# EAGLE schematic Test2 (EAGLE 7.2.0)
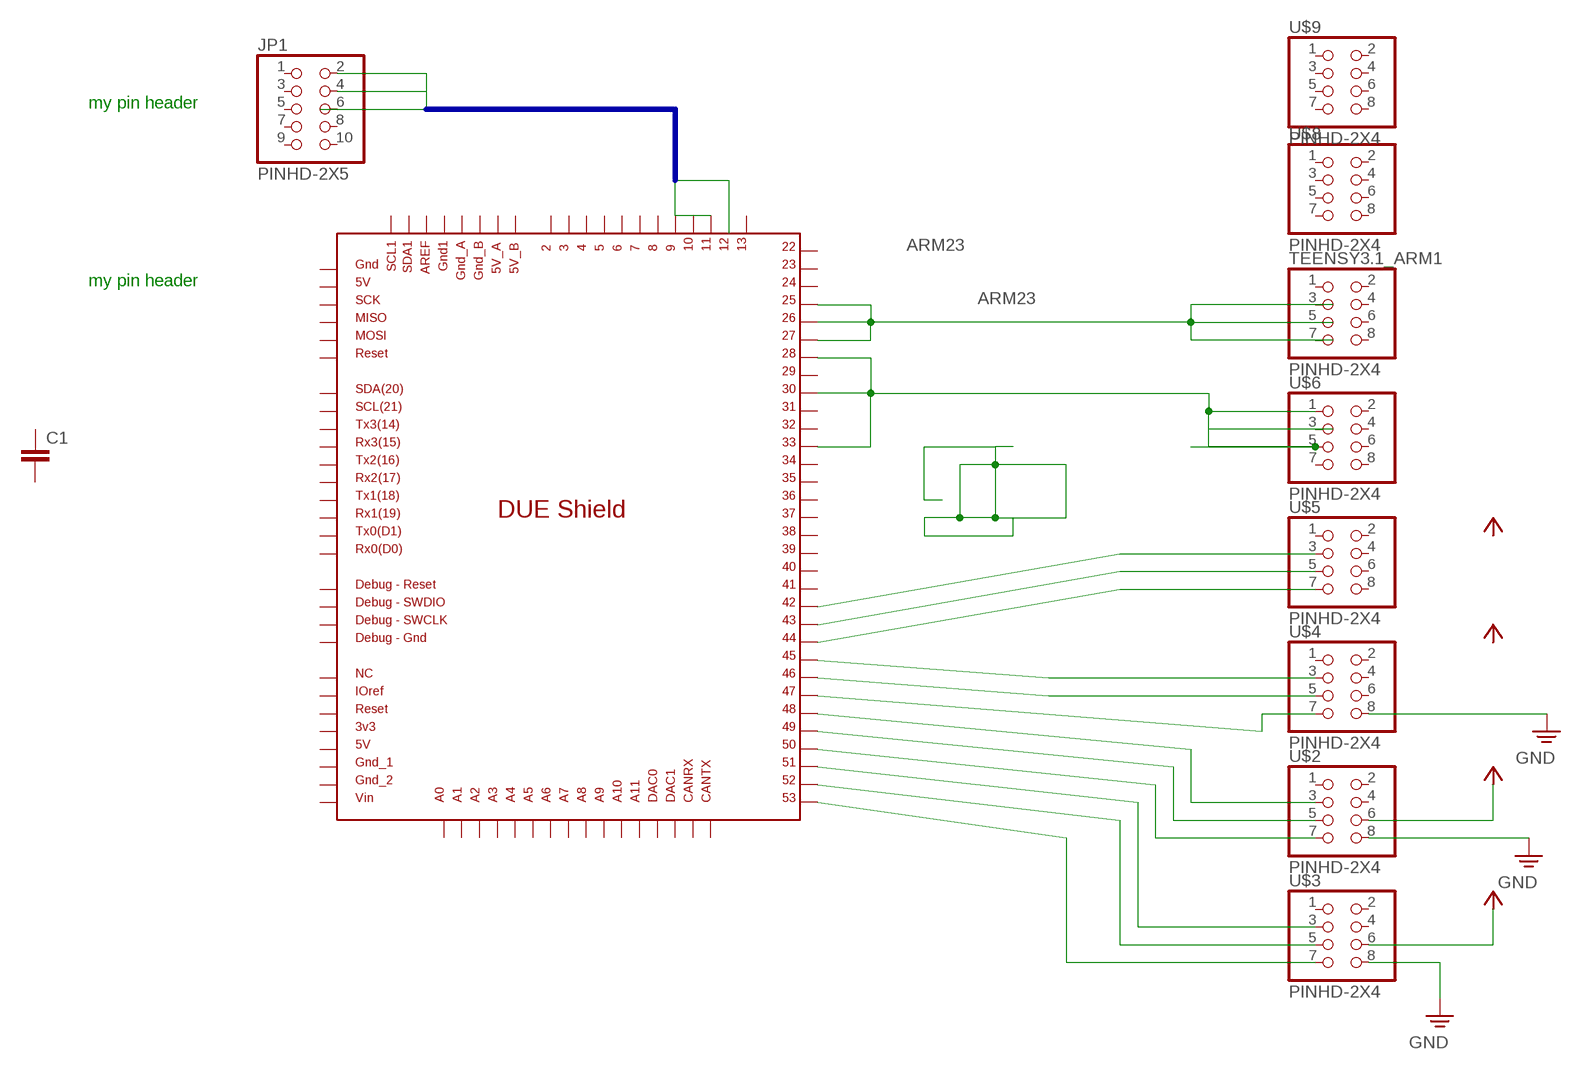
[diagram p0: schematic, sheet 1]

## Parts
C1  C_0201  [0201]
JP1  PINHD-2X5  [2X05]
TEENSY3.1_ARM1  PINHD-2X4  [2X04-BIG]
U$1  DUE(NORMAL)  [DUE(NORMAL)]
U$2  PINHD-2X4  [2X04-BIG]
U$3  PINHD-2X4  [2X04-BIG]
U$4  PINHD-2X4  [2X04-BIG]
U$5  PINHD-2X4  [2X04-BIG]
U$6  PINHD-2X4  [2X04-BIG]
U$8  PINHD-2X4  [2X04-BIG]
U$9  PINHD-2X4  [2X04-BIG]

## Nets
ARM23: U$1.25 U$1.26 U$1.27
B$1: JP1.2 JP1.4 U$1.11
GND: U$2.8 U$3.8 U$4.8
N$1: U$1.53 U$3.7
N$2: U$1.52 U$3.5
N$3: U$1.51 U$3.3
N$4: U$1.50 U$2.7
N$5: U$1.49 U$2.5
N$6: U$1.48 U$2.3
N$7: U$1.47 U$4.7
N$8: U$3.6
N$9: U$1.46 U$4.5
N$10: U$1.45 U$4.3
N$11: U$1.44 U$5.7
N$12: U$1.43 U$5.5
N$13: U$1.42 U$5.3
N$14: U$2.6
N$15: U$1.28 U$1.30 U$1.33 U$6.1 U$6.5
Unconnected: C1.1 C1.2 JP1.1 JP1.3 JP1.5 JP1.6 JP1.7 JP1.8 JP1.9 JP1.10 TEENSY3.1_ARM1.1 TEENSY3.1_ARM1.2 TEENSY3.1_ARM1.3 TEENSY3.1_ARM1.4 TEENSY3.1_ARM1.5 TEENSY3.1_ARM1.6 TEENSY3.1_ARM1.7 TEENSY3.1_ARM1.8 U$1.2 U$1.3 U$1.3V3 U$1.4 U$1.5 U$1.5V U$1.5V_A U$1.5V_B U$1.5V_ICSP U$1.6 U$1.7 U$1.8 U$1.9 U$1.10 U$1.12 U$1.13 U$1.22 U$1.23 U$1.24 U$1.29 U$1.31 U$1.32 U$1.34 U$1.35 U$1.36 U$1.37 U$1.38 U$1.39 U$1.40 U$1.41 U$1.A0 U$1.A1 U$1.A2 U$1.A3 U$1.A4 U$1.A5 U$1.A6 U$1.A7 U$1.A8 U$1.A9 U$1.A10 U$1.A11 U$1.AREF U$1.CANRX U$1.CANTX U$1.DAC0 U$1.DAC1 U$1.GND1 U$1.GND_1 U$1.GND_2 U$1.GND_A U$1.GND_B U$1.GND_DEBUG U$1.GND_ICSP U$1.IOREF U$1.MISO_ICSP U$1.MOSI_ICSP U$1.NC U$1.RESET U$1.RESET_DEBUG U$1.RESET_ICSP U$1.RX0 U$1.RX1 U$1.RX2 U$1.RX3 U$1.SCK_ICSP U$1.SCL U$1.SCL1 U$1.SDA U$1.SDA1 U$1.SWCLK_DEBUG U$1.SWDIO_DEBUG U$1.TX0 U$1.TX1 U$1.TX2 U$1.TX3 U$1.VIN U$2.1 U$2.2 U$2.4 U$3.1 U$3.2 U$3.4 U$4.1 U$4.2 U$4.4 U$4.6 U$5.1 U$5.2 U$5.4 U$5.6 U$5.8 U$6.2 U$6.3 U$6.4 U$6.6 U$6.7 U$6.8 U$8.1 U$8.2 U$8.3 U$8.4 U$8.5 U$8.6 U$8.7 U$8.8 U$9.1 U$9.2 U$9.3 U$9.4 U$9.5 U$9.6 U$9.7 U$9.8

## Buses
B$1

## Notes on the sheet
- my pin header
- my pin header

## Library data of the parts
C1 = jonnew:C: Capacitor
JP1 = jonnew:PINHD-2X5
TEENSY3.1_ARM1 U$2-U$6 U$8 U$9 = jonnew:PINHD-2X4
U$1 = DUElib130425:DUE(NORMAL)